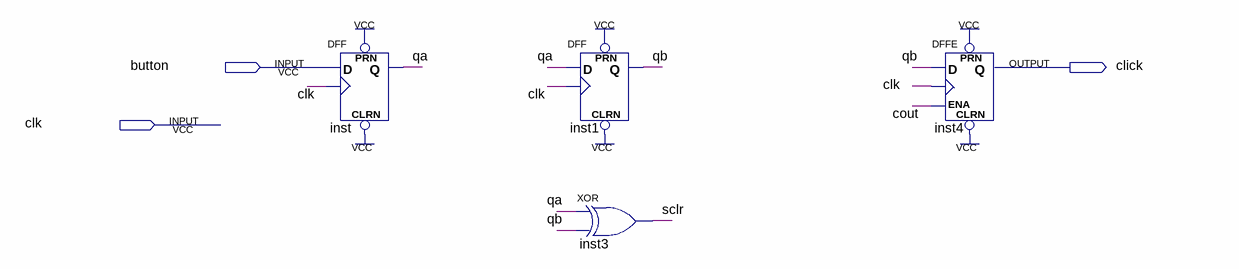
[diagram p0: schematic sheet]
// Quartus schematic debounce.bdf as structural Verilog: 4 symbols, 3 pins
module debounce (
  input  button,
  input  clk,
  output click
);

  wire cout, qa, qb, sclr;

  DFF inst (.CLRN(1'b1), .CLK(clk), .D(button), .PRN(1'b1), .Q(qa));
  DFF inst1 (.CLRN(1'b1), .CLK(clk), .D(qa), .PRN(1'b1), .Q(qb));
  xor inst3 (sclr, qa, qb);
  DFFE inst4 (.PRN(1'b1), .CLRN(1'b1), .D(qb), .CLK(clk), .ENA(cout), .Q(click));
endmodule
